# EAGLE design Board (EAGLE 9.2.2)
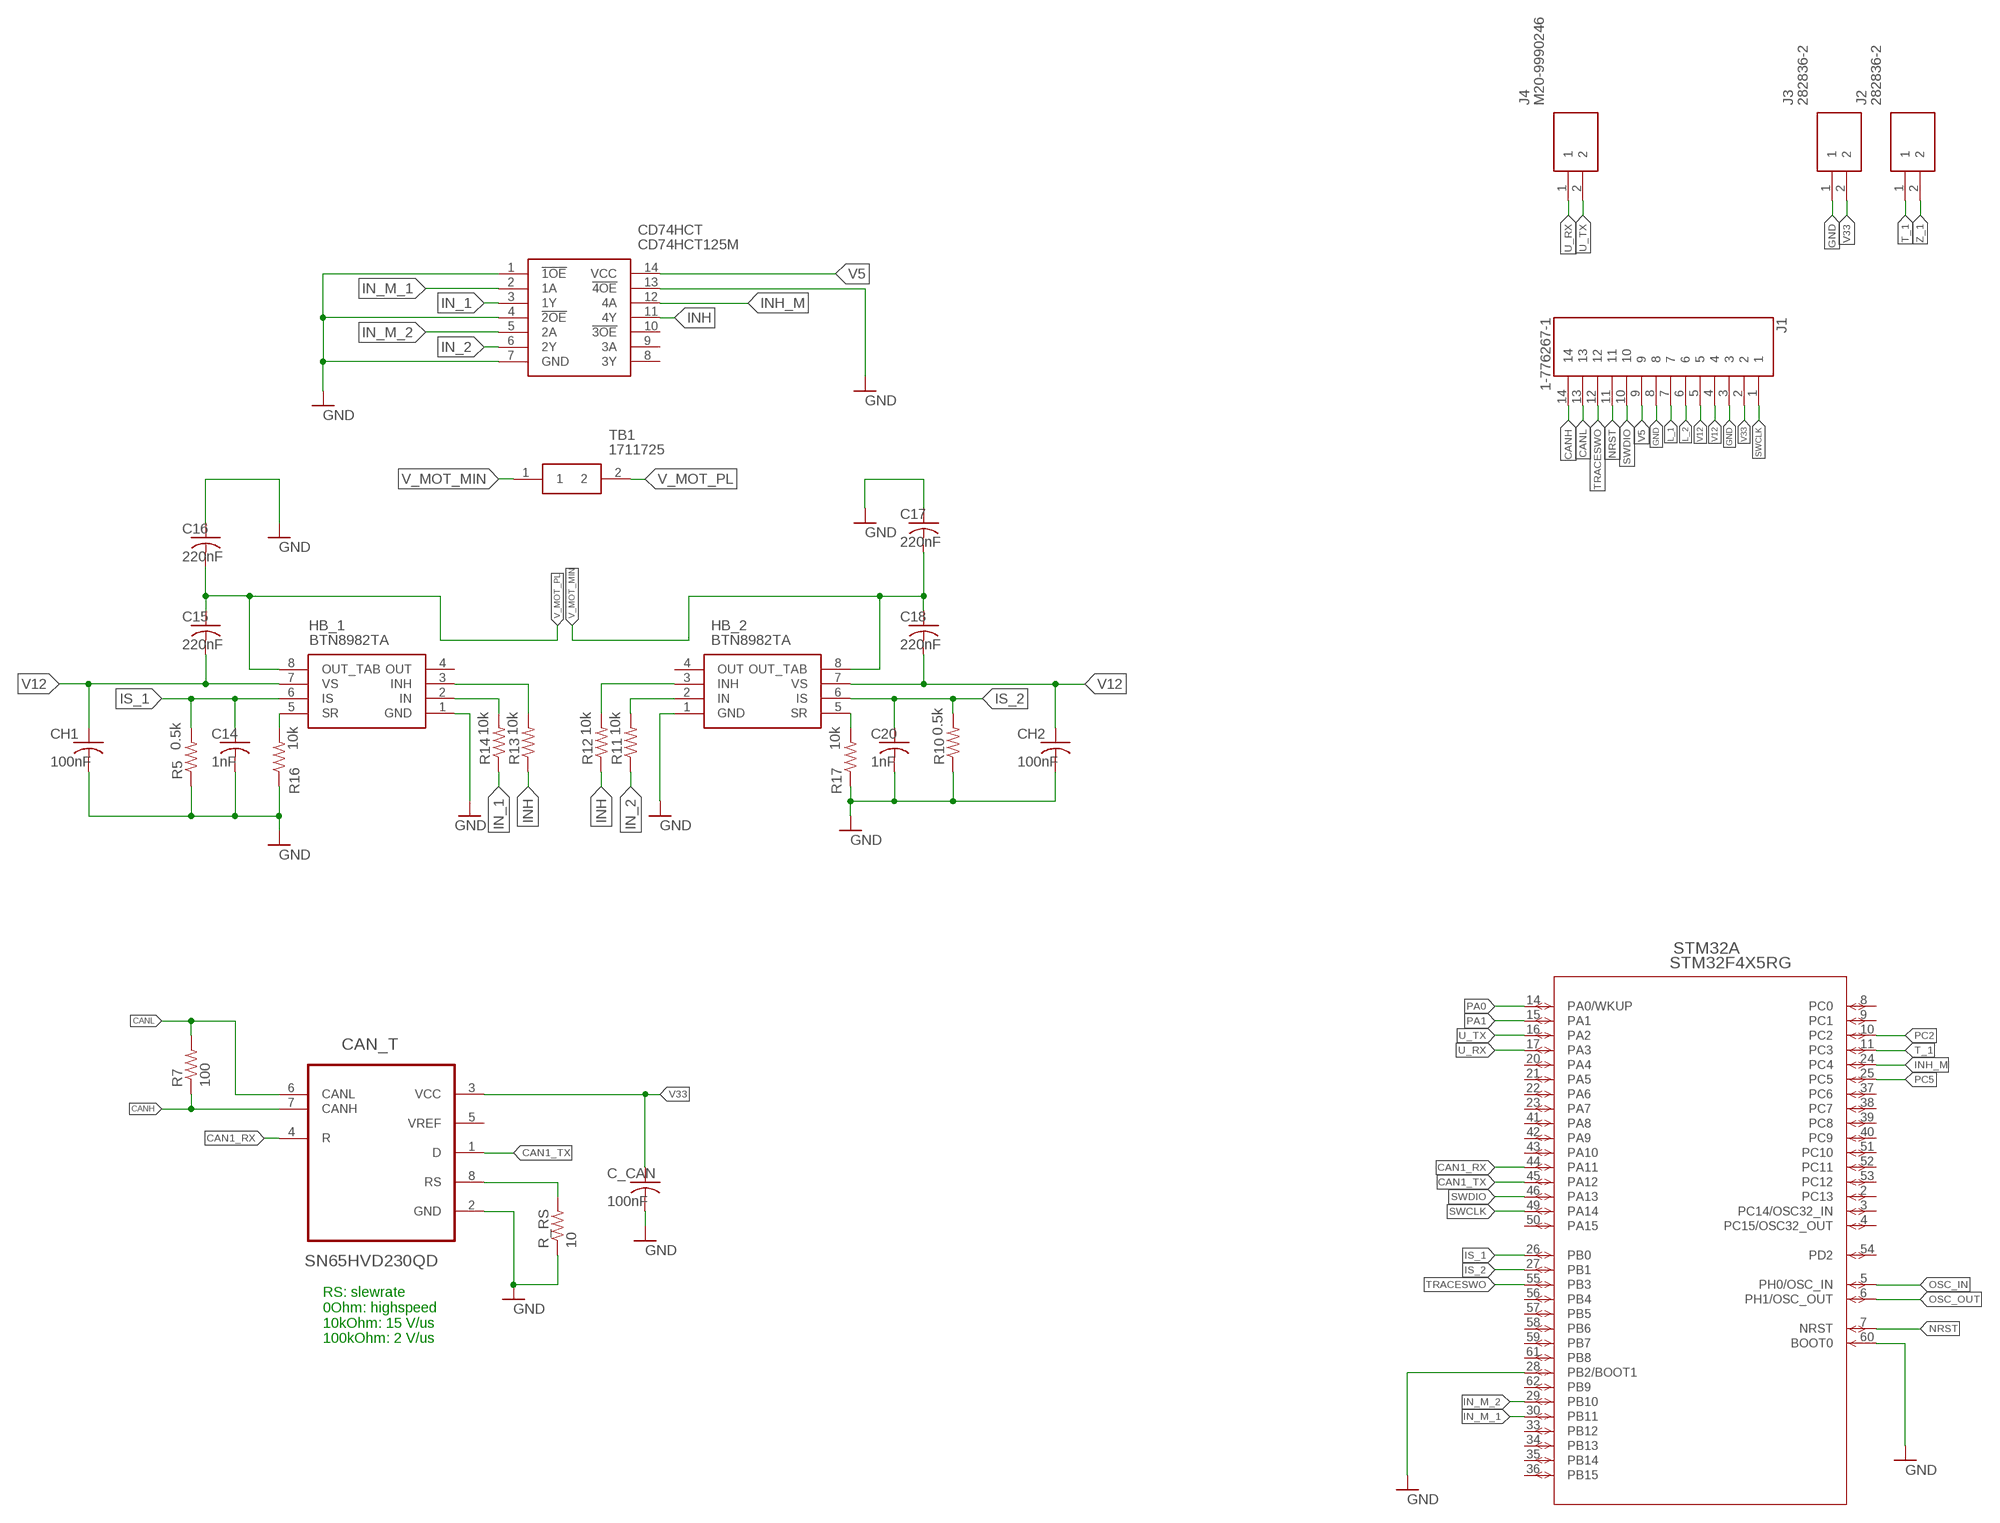
[diagram p0: schematic, sheet 1, part 1 of 2]
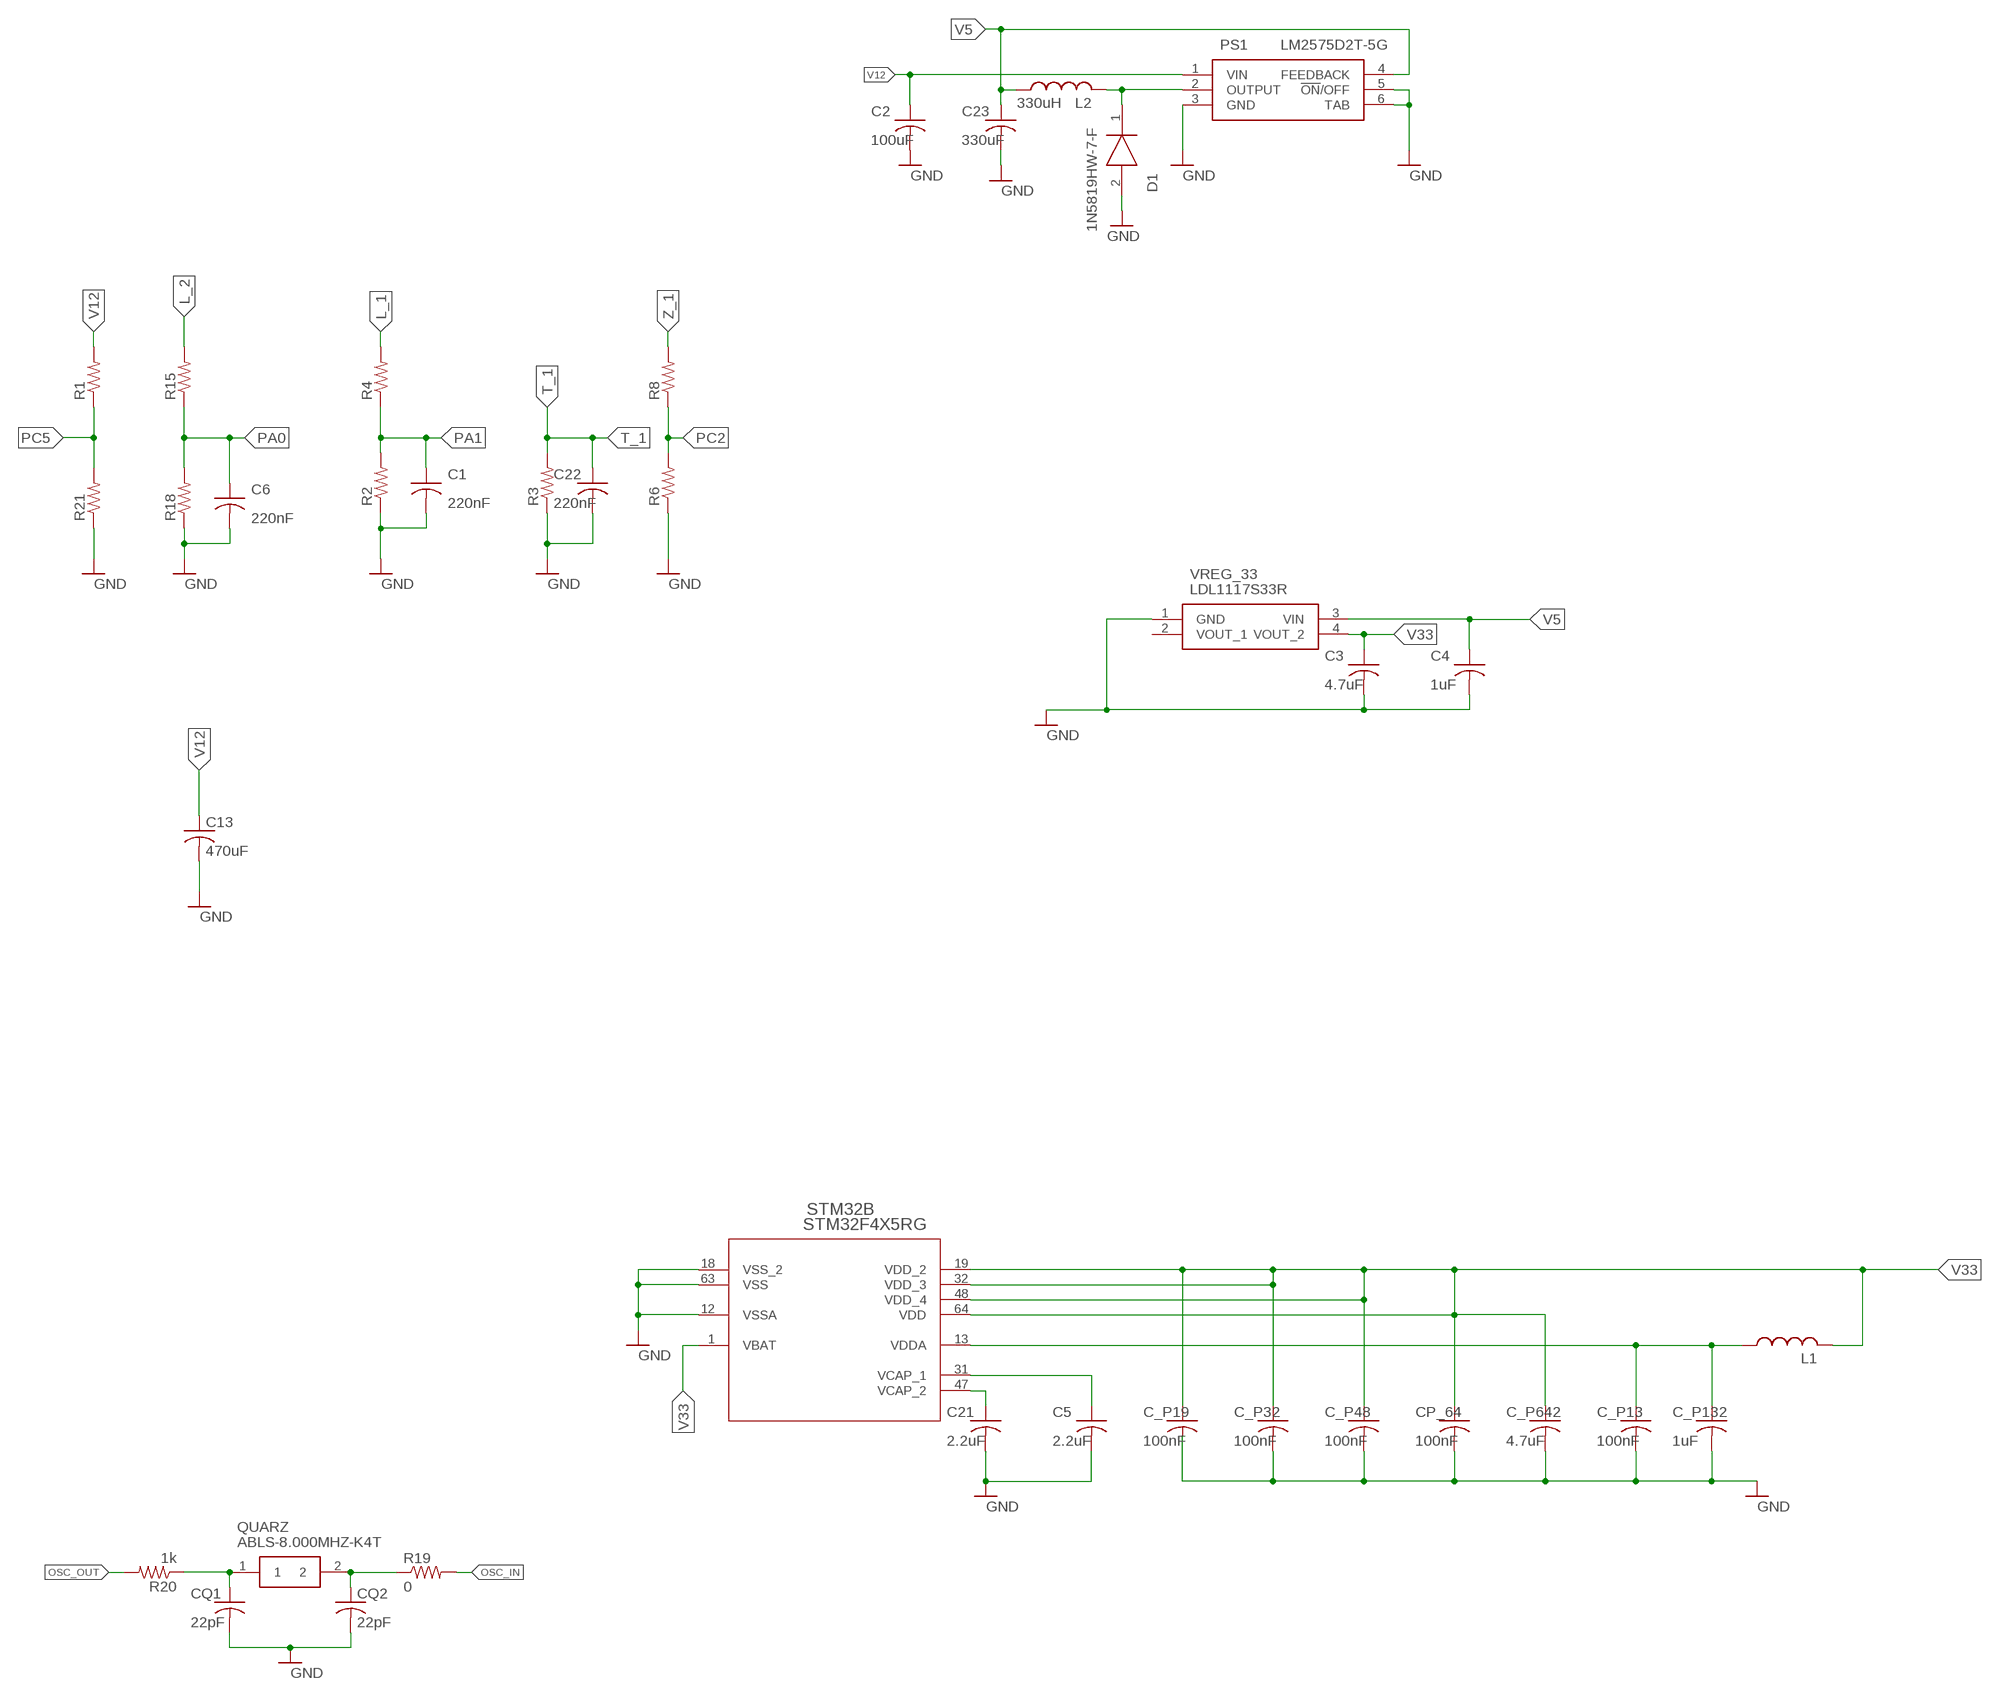
[diagram p1: schematic, sheet 1, part 2 of 2]

## Parts
C1  220nF  C-USC0805  [C0805]
C2  100uF  C-USC0805  [C0805]
C3  4.7uF  C-USC0805  [C0805]
C4  1uF  C-USC0805  [C0805]
C5  2.2uF  C-USC0805  [C0805]
C6  220nF  C-USC0805  [C0805]
C13  470uF  C-US050-075X075  [C050-075X075]
C14  1nF  C-USC0805  [C0805]
C15  220nF  C-USC0805  [C0805]
C16  220nF  C-USC0805  [C0805]
C17  220nF  C-USC0805  [C0805]
C18  220nF  C-USC0805  [C0805]
C20  1nF  C-USC0805  [C0805]
C21  2.2uF  C-USC0805  [C0805]
C22  220nF  C-USC0805  [C0805]
C23  330uF  C-USC0805  [C0805]
C_CAN  100nF  C-USC0805  [C0805]
C_P13  100nF  C-USC0805  [C0805]
C_P19  100nF  C-USC0805  [C0805]
C_P32  100nF  C-USC0805  [C0805]
C_P48  100nF  C-USC0805  [C0805]
C_P132  1uF  C-USC0805  [C0805]
C_P642  4.7uF  C-USC0805  [C0805]
CAN_T  SN65HVD230QD  [SOIC127P600X175-8N]
CD74HCT  CD74HCT125M  [SOIC127P600X175-14N]
CH1  100nF  C-USC0805  [C0805]
CH2  100nF  C-USC0805  [C0805]
CP_64  100nF  C-USC0805  [C0805]
CQ1  22pF  C-USC0805  [C0805]
CQ2  22pF  C-USC0805  [C0805]
D1  1N5819HW-7-F  [SOD3716X145N]
HB_1  BTN8982TA  [TO127P1500X440-8N]
HB_2  BTN8982TA  [TO127P1500X440-8N]
J1  1-776267-1  [TE_1-776267-1]
J2  282836-2  [SHDR2W100P0X500_1X2_1000X820X1]
J3  282836-2  [SHDR2W100P0X500_1X2_1000X820X1]
J4  M20-9990246  [HDRV2W64P0X254_1X2_508X254X864]
L1  INDUCTOR_0805_N  [RESC0805_N]
L2  330uH  INDUCTOR_0805_N  [RESC0805_N]
PS1  LM2575D2T-5G  [D2TSUFFIX-CASE936A-02-ISSUEC]
QUARZ  ABLS-8.000MHZ-K4T  [ABLS-12.000MHZ-B2]
R1  R-US_R0805  [R0805]
R2  R-US_R0805  [R0805]
R3  R-US_R0805  [R0805]
R4  R-US_R0805  [R0805]
R5  0.5k  R-US_R0805  [R0805]
R6  R-US_R0805  [R0805]
R7  100  R-US_R0805  [R0805]
R8  R-US_R0805  [R0805]
R10  0.5k  R-US_R0805  [R0805]
R11  10k  R-US_R0805  [R0805]
R12  10k  R-US_R0805  [R0805]
R13  10k  R-US_R0805  [R0805]
R14  10k  R-US_R0805  [R0805]
R15  R-US_R0805  [R0805]
R16  10k  R-US_R0805  [R0805]
R17  10k  R-US_R0805  [R0805]
R18  R-US_R0805  [R0805]
R19  0  R-US_R0805  [R0805]
R20  1k  R-US_R0805  [R0805]
R21  R-US_R0805  [R0805]
R_RS  10  R-US_R0805  [R0805]
STM32  STM32F4X5RG  [LQFP64-10X10MM]
TB1  1711725  [PHEONIX-5.08PITCH-2PIN]
VREG_33  LDL1117S33R  [SOT230P700X180-4N]

## Nets
CAN1_RX: CAN_T.4(R) STM32.44(A:PA11)
CAN1_TX: CAN_T.1(D) STM32.45(A:PA12)
CAN_RS: CAN_T.8(RS) R_RS.2
CANH: CAN_T.7(CANH) J1.14 R7.1
CANL: CAN_T.6(CANL) J1.13 R7.2
GND: C1.2 C2.2 C3.2 C4.2 C5.2 C6.2 C13.2 C14.2 C16.1 C17.1 C20.2 C21.2 C22.2 C23.2 C_CAN.2 C_P13.2 C_P19.2 C_P32.2 C_P48.2 C_P132.2 C_P642.2 CAN_T.2(GND) CD74HCT.1(!1OE) CD74HCT.4(!2OE) CD74HCT.7(GND) CD74HCT.13(!4OE) CH1.2 CH2.2 CP_64.2 CQ1.2 CQ2.2 D1.2(A) HB_1.1(GND) HB_2.1(GND) J1.3 J1.8 J3.1 PS1.3(GND) PS1.5(!ON!/OFF) PS1.6(TAB) R2.1 R3.1 R5.1 R6.1 R10.1 R16.1 R17.1 R18.1 R21.1 R_RS.1 STM32.12(B:VSSA) STM32.18(B:VSS_2) STM32.28(A:PB2/BOOT1) STM32.60(A:BOOT0) STM32.63(B:VSS) VREG_33.1(GND)
HB1_IN: HB_1.2(IN) R14.2
HB1_INH: HB_1.3(INH) R13.2
HB2_IN: HB_2.2(IN) R11.2
HB2_INH: HB_2.3(INH) R12.2
IN_1: CD74HCT.3(1Y) R14.1
IN_2: CD74HCT.6(2Y) R11.1
IN_M_1: CD74HCT.2(1A) STM32.30(A:PB11)
IN_M_2: CD74HCT.5(2A) STM32.29(A:PB10)
INH: CD74HCT.11(4Y) R12.1 R13.1
INH_M: CD74HCT.12(4A) STM32.24(A:PC4)
IS_1: C14.1 HB_1.6(IS) R5.2 STM32.26(A:PB0)
IS_2: C20.1 HB_2.6(IS) R10.2 STM32.27(A:PB1)
L_1: J1.7 R4.2
L_2: J1.6 R15.2
N$2: D1.1(K) L2.2 PS1.2(OUTPUT)
NRST: J1.11 STM32.7(A:NRST)
OSC_IN: R19.2 STM32.5(A:PH0/OSC_IN)
OSC_OUT: R20.2 STM32.6(A:PH1/OSC_OUT)
PA0: C6.1 R15.1 R18.2 STM32.14(A:PA0/WKUP)
PA1: C1.1 R2.2 R4.1 STM32.15(A:PA1)
PC2: R6.2 R8.1 STM32.10(A:PC2)
PC5: R1.1 R21.2 STM32.25(A:PC5)
Q_IN: CQ2.1 QUARZ.2 R19.1
Q_OUT: CQ1.1 QUARZ.1 R20.1
SR1: HB_1.5(SR) R16.2
SR2: HB_2.5(SR) R17.2
SWCLK: J1.1 STM32.49(A:PA14)
SWDIO: J1.10 STM32.46(A:PA13)
T_1: C22.1 J2.1 R3.2 STM32.11(A:PC3)
TRACESWO: J1.12 STM32.55(A:PB3)
U_RX: J4.1 STM32.17(A:PA3)
U_TX: J4.2 STM32.16(A:PA2)
V5: C4.1 C23.1 CD74HCT.14(VCC) J1.9 L2.1 PS1.4(FEEDBACK) VREG_33.3(VIN)
V12: C2.1 C13.1 C15.2 C18.2 CH1.1 CH2.1 HB_1.7(VS) HB_2.7(VS) J1.4 J1.5 PS1.1(VIN) R1.2
V33: C3.1 C_CAN.1 C_P19.1 C_P32.1 C_P48.1 C_P642.1 CAN_T.3(VCC) CP_64.1 J1.2 J3.2 L1.2 STM32.1(B:VBAT) STM32.19(B:VDD_2) STM32.32(B:VDD_3) STM32.48(B:VDD_4) STM32.64(B:VDD) VREG_33.4(VOUT_2)
V_MOT_MIN: C17.2 C18.1 HB_2.8(OUT_TAB) TB1.1
V_MOT_PL: C15.1 C16.2 HB_1.8(OUT_TAB) TB1.2
VCAP_1: C5.1 STM32.31(B:VCAP_1)
VCAP_2: C21.1 STM32.47(B:VCAP_2)
VDDA: C_P13.1 C_P132.1 L1.1 STM32.13(B:VDDA)
Z_1: J2.2 R8.2
Unconnected: CAN_T.5(VREF) CD74HCT.8(3Y) CD74HCT.9(3A) CD74HCT.10(!3OE) HB_1.4(OUT) HB_2.4(OUT) STM32.2(A:PC13) STM32.3(A:PC14/OSC32_IN) STM32.4(A:PC15/OSC32_OUT) STM32.8(A:PC0) STM32.9(A:PC1) STM32.20(A:PA4) STM32.21(A:PA5) STM32.22(A:PA6) STM32.23(A:PA7) STM32.33(A:PB12) STM32.34(A:PB13) STM32.35(A:PB14) STM32.36(A:PB15) STM32.37(A:PC6) STM32.38(A:PC7) STM32.39(A:PC8) STM32.40(A:PC9) STM32.41(A:PA8) STM32.42(A:PA9) STM32.43(A:PA10) STM32.50(A:PA15) STM32.51(A:PC10) STM32.52(A:PC11) STM32.53(A:PC12) STM32.54(A:PD2) STM32.56(A:PB4) STM32.57(A:PB5) STM32.58(A:PB6) STM32.59(A:PB7) STM32.61(A:PB8) STM32.62(A:PB9) VREG_33.2(VOUT_1)

## Notes on the sheet
- RS: slewrate
  0Ohm: highspeed
  10kOhm: 15 V/us
  100kOhm: 2 V/us

## Library data of the parts
C1-C6 C13-C18 C20-C23 C_CAN C_P13 C_P19 C_P32 C_P48 C_P132 C_P642 CH1 CH2 CP_64 CQ1 CQ2 = adafruit:C-US: CAPACITOR, American symbol
CAN_T = ADP_Components:SN65HVD230QD: 3.3-V CAN TRANSCEIVERS; MF: TEXAS INSTRUMENTS; MPN: SN65HVD230QD..; OC_FARNELL: 1648752; OC_NEWARK: 75C7746; PACKAGE: SOIC-8; SUPPLIER: Texas Instruments
CD74HCT = SamacSys_Parts:CD74HCT125M: High Speed CMOS Logic Quad Buffers with 3-State Outputs Source: Datasheet <http://www.ti.com/lit/ds/symlink/cd74hct125.pdf>; DESCRIPTION: High Speed CMOS Logic Quad Buffers with 3-State Outputs; HEIGHT: 1.75mm; MANUFACTURER_NAME: Texas Instruments; MANUFACTURER_PART_NUMBER: CD74HCT125M; MOUSER_PART_NUMBER: 595-CD74HCT125M
D1 = SamacSys_Parts:1N5819HW-7-F: Diode Schottky 1A 40V SOD123 Diodes Inc 1N5819HW-7-F, SMT Schottky Diode, 40V 1A, 2-Pin SOD-123 Source: Datasheet <https://componentsearchengine.com/Datasheets/1/1N5819HW-7-F.pdf>; DESCRIPTION: Diode Schottky 1A 40V SOD123 Diodes Inc 1N5819HW-7-F, SMT Schottky Diode, 40V 1A, 2-Pin SOD-123; HEIGHT: 1.45mm; MANUFACTURER_NAME: Diodes Inc.; MANUFACTURER_PART_NUMBER: 1N5819HW-7-F; MOUSER_PART_NUMBER: 621-1N5819HW-F; MOUSER_PRICE-STOCK: https://www.mouser.com/Search/Refine.aspx?Keyword=621-1N5819HW-F
HB_1 HB_2 = SamacSys_Parts:BTN8982TA: New Infineon BTN8982TA Motor Driver,, 7-Pin TO-263-7-1 Source: Datasheet <http://www.mouser.com/datasheet/2/196/Infineon-BTN8982TA-DS-v01_00-EN-786008.pdf>; DESCRIPTION: New Infineon BTN8982TA Motor Driver,, 7-Pin TO-263-7-1; HEIGHT: 4.4mm; MANUFACTURER_NAME: Infineon; MANUFACTURER_PART_NUMBER: BTN8982TA; MOUSER_PART_NUMBER: 726-BTN8982TA
J1 = 1-776267-1:1-776267-1: AMPSEAL 14 Position 4 mm Pitch Triple Row Wire to Board Right Angle Header; COMMENT: 1-776267-1; DESCRIPTION: AMPSEAL 14 Position 4 mm Pitch Triple Row Wire to Board Right Angle Header; DIGI-KEY_PART_NUMBER: A142413-ND; DIGI-KEY_PURCHASE_URL: https://www.digikey.com/product-detail/en/te-connectivity-amp-connectors/1-776267-1/A142413-ND/5428565?utm_source=snapeda&utm_medium=aggregator&utm_campaign=symbol; EU_ROHS_COMPLIANCE: Compliant; MF: TE Connectivity; MP: 1-776267-1; PACKAGE: None; TE_PURCHASE_URL: https://www.te.com/usa-en/product-1-776267-1.html?te_bu=Cor&te_type=disp&te_campaign=seda_glo_cor-seda-global-disp-prtnr-fy19-seda-model-bom-cta_sma-317_1&elqCampaignId=32493
J2 J3 = SamacSys_Parts:282836-2: TERMINAL BLOCK, PCB MOUNT, SIDE WIRE ENTRY, STACKING , 5.00mm PITCH Source: Datasheet <http://www.mouser.com/datasheet/2/418/NG_CD_282836_H10-1248046.pdf>; DESCRIPTION: TERMINAL BLOCK, PCB MOUNT, SIDE WIRE ENTRY, STACKING , 5.00mm PITCH; HEIGHT: 10.2mm; MANUFACTURER_NAME: TE Connectivity; MANUFACTURER_PART_NUMBER: 282836-2; MOUSER_PART_NUMBER: 571-2828362
J4 = SamacSys_Parts:M20-9990246: HARWIN M20-9990246. Board-To-Board Connector, Straight, 2.54 mm, 2 Contacts, Header, M20 Series, Through Hole Source: Datasheet <http://www.mouser.com/datasheet/2/181/M20-999-1218971.pdf>; DESCRIPTION: HARWIN M20-9990246. Board-To-Board Connector, Straight, 2.54 mm, 2 Contacts, Header, M20 Series, Through Hole; HEIGHT: 8.64mm; MANUFACTURER_NAME: HARWIN; MANUFACTURER_PART_NUMBER: M20-9990246; MOUSER_PART_NUMBER: 855-M20-9990246
L1 L2 = Nordic_nRF:INDUCTOR: Generic chip inductor
PS1 = SamacSys_Parts:LM2575D2T-5G: ON SEMICONDUCTOR - LM2575D2T-5G - IC, POWER SUPPLY D2PAK Source: Datasheet <https://componentsearchengine.com/Datasheets/1/LM2575D2T-5G.pdf>; DESCRIPTION: ON SEMICONDUCTOR - LM2575D2T-5G - IC, POWER SUPPLY D2PAK; HEIGHT: mm; MANUFACTURER_NAME: ON Semiconductor; MANUFACTURER_PART_NUMBER: LM2575D2T-5G; MOUSER_PART_NUMBER: 863-LM2575D2T-5G; MOUSER_PRICE-STOCK: https://www.mouser.com/Search/Refine.aspx?Keyword=863-LM2575D2T-5G
QUARZ = SamacSys_Parts:ABLS-8.000MHZ-K4T: ABRACON - ABLS-8.000MHZ-K4T - CRYSTAL, 8MHZ, 18PF, HC-49US Source: Datasheet <https://componentsearchengine.com/Datasheets/1/ABLS-8.000MHZ-K4T.pdf>; DESCRIPTION: ABRACON - ABLS-8.000MHZ-K4T - CRYSTAL, 8MHZ, 18PF, HC-49US; HEIGHT: mm; MANUFACTURER_NAME: ABRACON; MANUFACTURER_PART_NUMBER: ABLS-8.000MHZ-K4T; MF: ABRACON; MOUSER_PART_NUMBER: 815-ABLS-8.0MK4-T; MPN: ABLS-8.000MHZ-K4T; OC_FARNELL: 2467758
R1-R8 R10-R15 R18 R21 R_RS = adafruit:R-US_: RESISTOR, American symbol
R16 R17 R19 R20 = resistor:R-US_: RESISTOR, American symbol
STM32 = ADP_Components:STM32F4X5RG; MANUFACTURER_PART_NUMBER: STM32F4X5RG; OC_FARNELL: unknown; VENDOR: STMicroelectronics
TB1 = SamacSys_Parts:1711725: Non-Fused Terminal Block Through Hole, 2 Way, Solder, Nylon, 250 V Source: Datasheet; DESCRIPTION: Non-Fused Terminal Block Through Hole, 2 Way, Solder, Nylon, 250 V; HEIGHT: mm; MANUFACTURER_NAME: Phoenix Contact; MANUFACTURER_PART_NUMBER: 1711725; MOUSER_PART_NUMBER: 651-1711725; MOUSER_PRICE-STOCK: https://www.mouser.com/Search/Refine.aspx?Keyword=651-1711725
VREG_33 = SamacSys_Parts:LDL1117S33R: STMICROELECTRONICS - LDL1117S33R - LDO, FIXED, 3.3V, 1.2A, SOT-223-3 Source: Datasheet <http://www.mouser.com/datasheet/2/389/ldl1117-1156241.pdf>; DESCRIPTION: STMICROELECTRONICS - LDL1117S33R - LDO, FIXED, 3.3V, 1.2A, SOT-223-3; HEIGHT: 1.8mm; MANUFACTURER_NAME: STMicroelectronics; MANUFACTURER_PART_NUMBER: LDL1117S33R; MF: STMICROELECTRONICS; MOUSER_PART_NUMBER: 511-LDL1117S33R; MPN: LDL1117S33R; OC_FARNELL: 2729708

## Net classes
0 default: width 0.2 mm, drill 0.508 mm
1 V12: width 0.6 mm, drill 0.8 mm

## Board
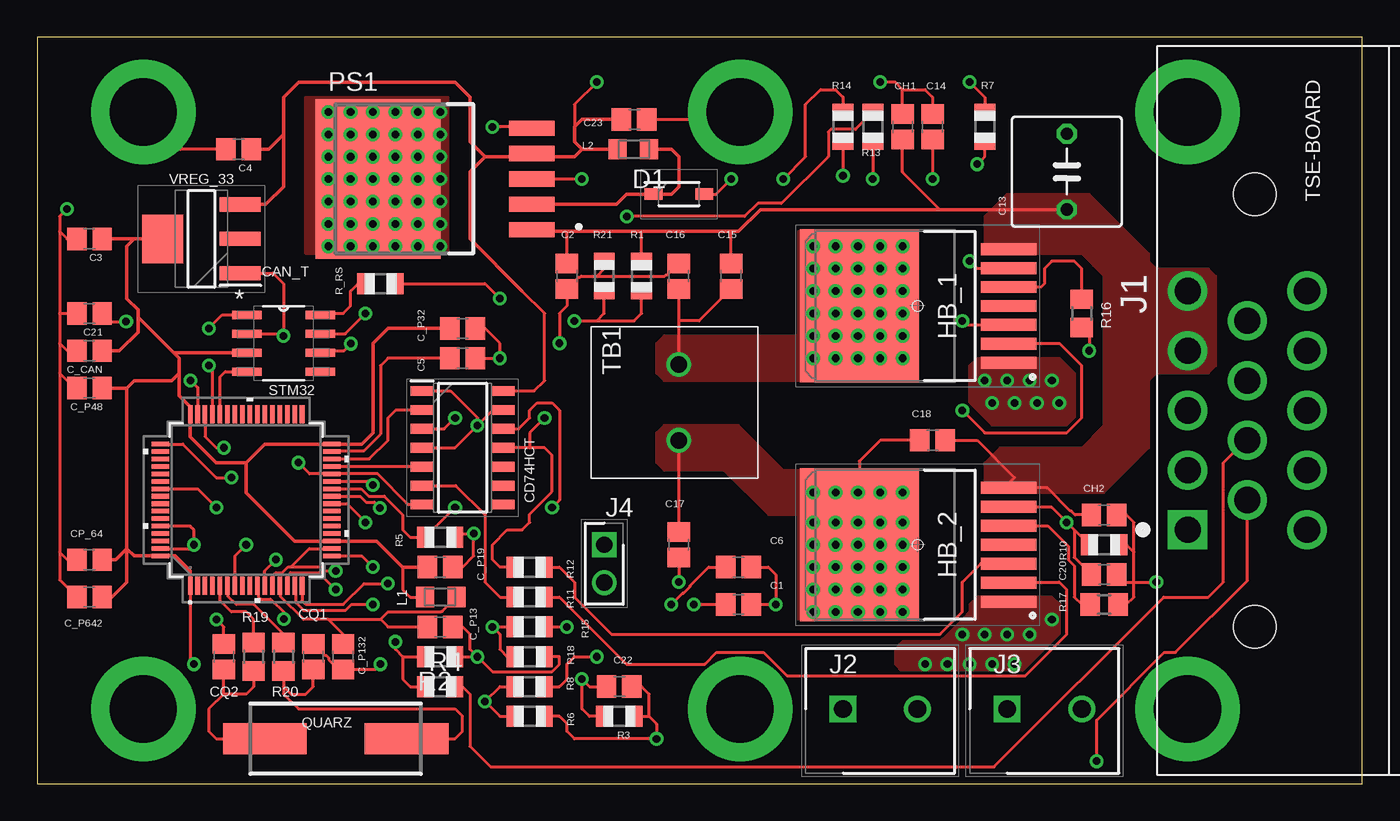
[diagram p2: board, top side]
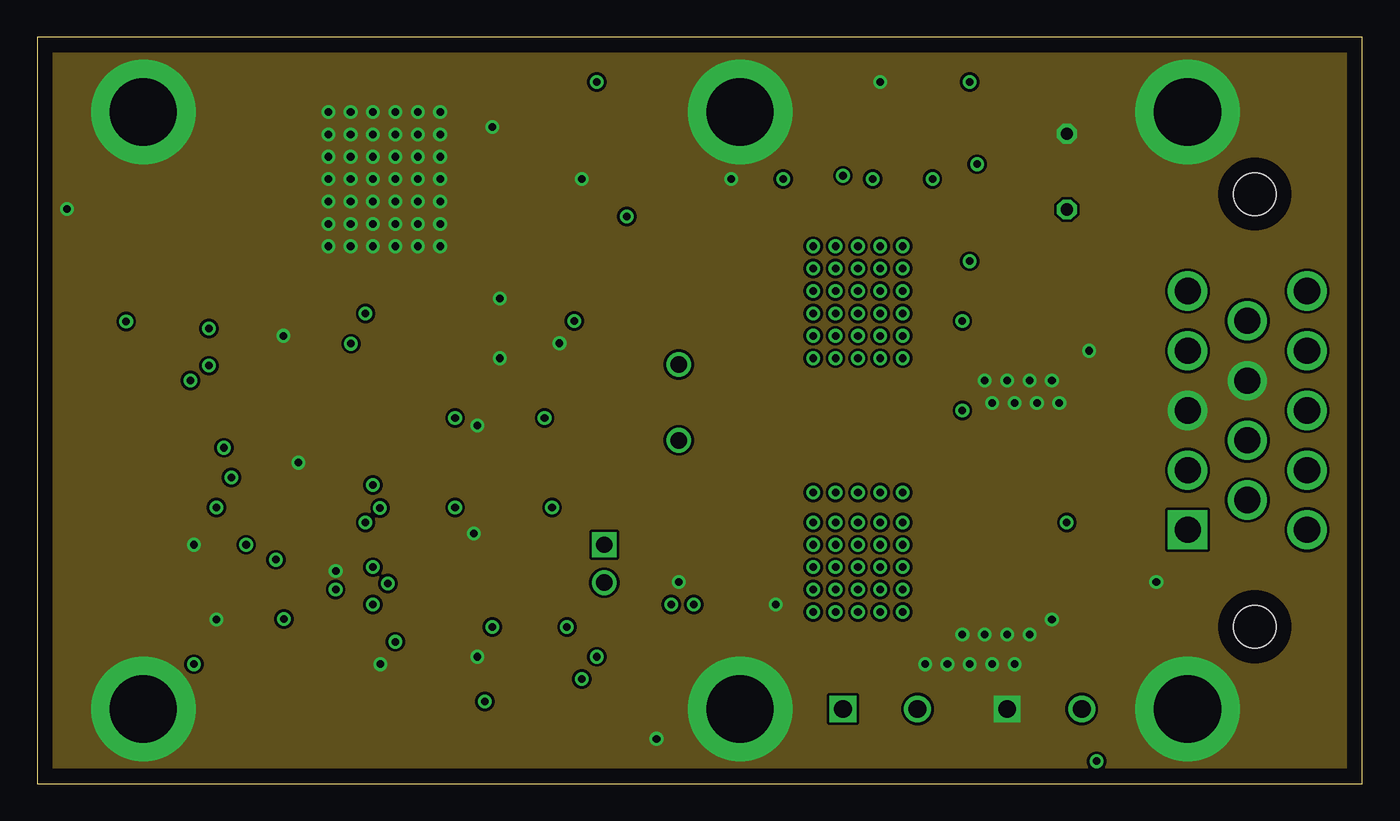
[diagram p3: board, inner layer Route2]
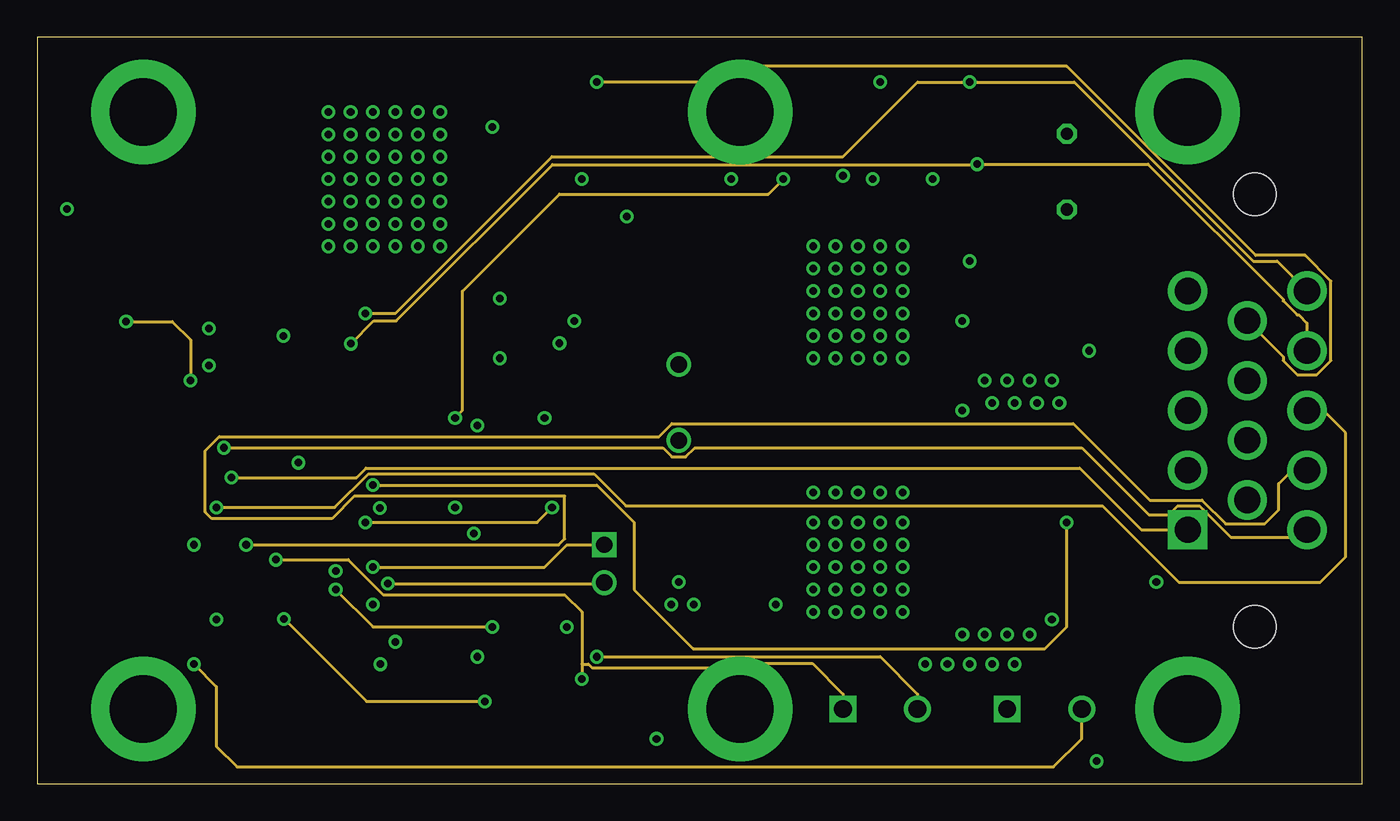
[diagram p4: board, inner layer Route15]
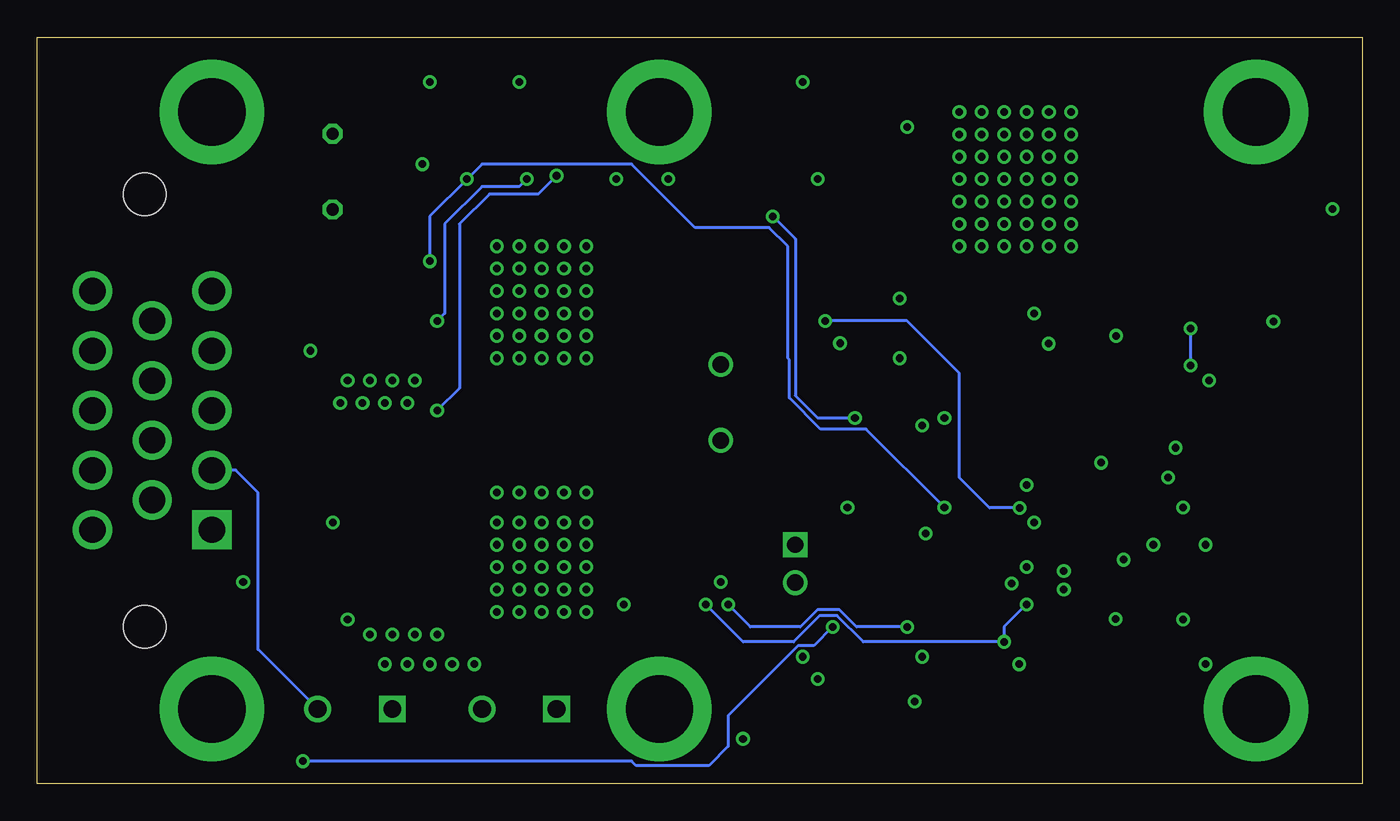
[diagram p5: board, bottom side, seen from below]

Size 88.8 x 50 mm. Coordinates in mm from the lower left corner, seen from the top.
Outline: 0,0 88.8,0 88.8,50 0,50 0,0
Copper layers (1+2*15+16): Top 0.07mm / dielectric 1.5mm / Route2 0.035mm / dielectric 0.15mm / Route15 0.035mm / dielectric 0.2mm / Bottom 0.07mm
Design rules "default *": minimum track width 6mil, minimum drill 0.35mm, track to track 0.19mm, track to pad 0.19mm, pad to pad 0.19mm, via to via 0.19mm, smd to smd 0.19mm, copper to edge 40mil, drill to drill 6mil, minimum pad ring 10mil, minimum via ring 8mil, stop-mask expansion 4mil, vias tented up to drill 0mil, thermal gap 10mil

### Footprints (pad centres in the part's own frame; a part is rotated, then mirrored left to right if it is on the bottom)
C0805 = smd 1.3 x 1.5: 1 -0.85,0; 2 0.85,0
C050-075X075 = drill 0.813 octagon: 1 -2.54,0; 2 2.54,0
SOIC127P600X175-8N = smd 1.981 x 0.559: 1 -2.464,1.905; 2 -2.464,0.635; 3 -2.464,-0.635; 4 -2.464,-1.905; 5 2.464,-1.905; 6 2.464,-0.635; 7 2.464,0.635; 8 2.464,1.905
SOIC127P600X175-14N = smd 1.525 x 0.65: 1 -2.712,3.81; 2 -2.712,2.54; 3 -2.712,1.27; 4 -2.712,0; 5 -2.712,-1.27; 6 -2.712,-2.54; 7 -2.712,-3.81; 8 2.712,-3.81; 9 2.712,-2.54; 10 2.712,-1.27; 11 2.712,0; 12 2.712,1.27; 13 2.712,2.54; 14 2.712,3.81
SOD3716X145N = smd 1.2 x 0.75: 1 -1.7,0; 2 1.7,0
TO127P1500X440-8N = smd 3.7 x 0.8: 1 -6.1,3.81; 2 -6.1,2.54; 3 -6.1,1.27; 4 -6.1,0; 5 -6.1,-1.27; 6 -6.1,-2.54; 7 -6.1,-3.81 | smd 8 x 10.25: 8 3.9,0
TE_1-776267-1 = drill 1.75 square: 1 -8,4.5 | drill 1.75: 2 -4,4.5; 3 0,4.5; 4 4,4.5; 5 8,4.5; 6 -6,0.5; 7 -2,0.5; 8 2,0.5; 9 6,0.5; 10 -8,-3.5; 11 -4,-3.5; 12 0,-3.5; 13 4,-3.5; 14 8,-3.5 | hole 2.85: -14.5,0; 14.5,0
SHDR2W100P0X500_1X2_1000X820X1 = drill 1.2 pad 1.8 square: 1 0,0 | drill 1.2 pad 1.8: 2 5,0
HDRV2W64P0X254_1X2_508X254X864 = drill 1.1 pad 1.65 square: 1 0,0 | drill 1.1 pad 1.65: 2 2.54,0
RESC0805_N = smd 1.2 x 1.35: 1 -1.1,0; 2 1,0
D2TSUFFIX-CASE936A-02-ISSUEC = smd 3.05 x 1.016: 1 13.155,1.606; 2 13.155,3.308; 3 13.155,5.01; 4 13.155,6.712; 5 13.155,8.414 | smd 8.38 x 10.66: 6 2.85,5.01
ABLS-12.000MHZ-B2 = smd 5.6 x 2.1: 1 -4.75,0; 2 4.75,0
R0805 = smd 1.1 x 1.4: 1 -1,0; 2 1,0
R0805' = smd 1.3 x 1.5: 1 -0.95,0; 2 0.95,0
LQFP64-10X10MM = smd 1.194 x 0.305: 1 -5.75,3.75; 2 -5.75,3.25; 3 -5.75,2.75; 4 -5.75,2.25; 5 -5.75,1.75; 6 -5.75,1.25; 7 -5.75,0.75; 8 -5.75,0.25; 9 -5.75,-0.25; 10 -5.75,-0.75; 11 -5.75,-1.25; 12 -5.75,-1.75; 13 -5.75,-2.25; 14 -5.75,-2.75; 15 -5.75,-3.25; 16 -5.75,-3.75; 33 5.75,-3.75; 34 5.75,-3.25; 35 5.75,-2.75; 36 5.75,-2.25; 37 5.75,-1.75; 38 5.75,-1.25; 39 5.75,-0.75; 40 5.75,-0.25; 41 5.75,0.25; 42 5.75,0.75; 43 5.75,1.25; 44 5.75,1.75; 45 5.75,2.25; 46 5.75,2.75; 47 5.75,3.25; 48 5.75,3.75 | smd 0.305 x 1.194: 17 -3.75,-5.75; 18 -3.25,-5.75; 19 -2.75,-5.75; 20 -2.25,-5.75; 21 -1.75,-5.75; 22 -1.25,-5.75; 23 -0.75,-5.75; 24 -0.25,-5.75; 25 0.25,-5.75; 26 0.75,-5.75; 27 1.25,-5.75; 28 1.75,-5.75; 29 2.25,-5.75; 30 2.75,-5.75; 31 3.25,-5.75; 32 3.75,-5.75; 49 3.75,5.75; 50 3.25,5.75; 51 2.75,5.75; 52 2.25,5.75; 53 1.75,5.75; 54 1.25,5.75; 55 0.75,5.75; 56 0.25,5.75; 57 -0.25,5.75; 58 -0.75,5.75; 59 -1.25,5.75; 60 -1.75,5.75; 61 -2.25,5.75; 62 -2.75,5.75; 63 -3.25,5.75; 64 -3.75,5.75
PHEONIX-5.08PITCH-2PIN = drill 1.1 pad 1.65: 1 0,0; 2 5.08,0
SOT230P700X180-4N = smd 2.75 x 0.95: 1 -2.6,2.3; 2 -2.6,0; 3 -2.6,-2.3 | smd 2.75 x 3.25: 4 2.6,0

### Placement (x,y rotation side)
C1  47,12 0 top
C2  35.5,34 270 top
C3  3.5,36.5 180 top
C4  13.5,42.5 180 top
C5  28.5,28.5 0 top
C6  47,14.5 0 top
C13  69,41 90 top
C14  60,44 90 top
C15  46.5,34 90 top
C16  43,34 270 top
C17  43,16 90 top
C18  60,23 0 top
C20  71.5,14 0 top
C21  3.5,31.5 180 top
C22  39,6.5 0 top
C23  40,44.5 0 top
C_CAN  3.5,29 180 top
C_P13  27,10.5 0 top
C_P19  27,14.5 0 top
C_P32  28.5,30.5 0 top
C_P48  3.5,26.5 180 top
C_P132  20.5,8.5 270 top
C_P642  3.5,12.5 180 top
CAN_T  16.5,29.5 0 top
CD74HCT  28.5,22.5 0 top
CH1  58,44 90 top
CH2  71.5,18 0 top
CP_64  3.5,15 180 top
CQ1  18.5,8.5 90 top
CQ2  12.5,8.5 90 top
D1  43,39.5 0 top
HB_1  59,32 180 top
HB_2  59,16 180 top
J1  81.6,25 90 top
J2  54,5 0 top
J3  65,5 0 top
J4  38,16 270 top
L1  27,12.5 180 top
L2  40,42.5 0 top
PS1  20,35.5 0 top
QUARZ  20,3 180 top
R1  40.5,34 90 top
R2  27,8.5 180 top
R3  39,4.5 180 top
R4  27,6.5 0 top
R5  27,16.5 180 top
R6  33,4.5 180 top
R7  63.5,44 270 top
R8  33,6.5 0 top
R10  71.5,16 180 top
R11  33,12.5 0 top
R12  33,14.5 0 top
R13  56,44 270 top
R14  54,44 270 top
R15  33,10.5 0 top
R16  10k  [R0805']  70,31.5 90 top
R17  10k  [R0805']  71.5,12 180 top
R18  33,8.5 180 top
R19  0  [R0805']  14.5,8.5 90 top
R20  1k  [R0805']  16.5,8.5 90 top
R21  38,34 270 top
R_RS  23,33.5 180 top
STM32  14,19 90 top
TB1  43,23 90 top
VREG_33  11,36.5 180 top

### Tracks (layer width: path | path; a pad name or v marks a point on that pad's centre or on a via)
CAN1_RX
  Top 0.2: STM32.44 12.25,27.25 12.6,27.59 CAN_T.4
CAN1_TX  (via drill 0.51)
  Top 0.2: STM32.45 11.75,27.75 v11.5,28 | v11.5,30.5 12.4,31.41 CAN_T.1
  Bottom 0.2: v11.5,28 v11.5,30.5
CAN_RS
  Top 0.2: CAN_T.8 19.06,31.5 20.5,31.5 21,32 21,33 21.5,33.5 R_RS.2
CANH  (via drill 0.51)
  Top 0.2: CAN_T.7 20.64,30.14 v22,31.5 | v62.5,47 63.5,46 R7.1
  Route15 0.2: v22,31.5 24,31.5 34.5,42 45.79,42 45.84,41.95 48.36,41.95 48.41,42 54,42 59,47 v62.5,47 69.5,47 81.5,35 83.1,35 J1.14
CANL  (via drill 0.51)
  Top 0.2: CAN_T.6 19.1,29 20.56,29 v21.03,29.47 | v63,41.5 63.5,42 R7.2
  Route15 0.2: v21.03,29.47 22.56,31 24.05,31 34.53,41.47 62.97,41.47 v63,41.5 74.45,41.5 83.5,32.45 83.5,32.34 84.44,31.4 84.55,31.4 85.1,30.85 J1.13
GND  (via drill 0.51, 4.5 pad 7)
  Top 0.2: v2,38.5 1.5,38 1.5,37 | 1.5,37 1.5,31.5 | 1.5,31.5 1.5,29.5 | 1.5,29.5 1.5,27.5 | 1.5,37 2,36.5 C3.2 | 1.5,31.5 C21.2 | 1.5,29.5 2,29 C_CAN.2 | 1.5,27.5 2.5,26.5 C_P48.2 | 1.5,27.5 1.5,15.5 | 1.5,15.5 1.5,13.65 C_P642.2 | 1.5,15.5 2,15 CP_64.2 | STM32.63 10.25,15.75 v10.5,16 10.5,17 10.25,17.25 STM32.60 | STM32.12 15.81,13.31 15.81,13.97 15.98,14.14 16.43,14.14 16.82,14.53 17,14.53 | v20,14.25 19.3,14.25 19.02,14.53 17,14.53 | v17.5,21.5 18.25,20.75 STM32.28 22.81,20.75 24.87,18.69 CD74HCT.7 | CD74HCT.4 28,22.5 v29.5,24 | v29.5,24 30.54,25.04 CD74HCT.13 | CD74HCT.1 27.69,26.31 29.5,24.5 v29.5,24 | C5.2 v31,28.5 31,29.5 30,30.5 C_P32.2 | R2.1 v29.5,8.5 | v29.5,8.5 30.5,7.5 34.5,7.5 35,8 35,8.5 R18.1 | R3.1 41,4.5 | 41,4.5 41.5,4 v41.5,3 36,3 35.5,3.5 35.5,4 35,4.5 R6.1 | 41,4.5 41,6 40.5,6.5 C22.2 | C17.1 v43,13.5 | R_RS.1 30,33.5 v31,32.5 | v35,29.5 35,31.5 35.5,32 C2.2 36.26,33.91 36.37,33.91 36.46,34 37.5,34 | 37.5,34 38,34.5 R21.1 | C16.1 42.24,34.09 42.13,34.09 42.04,34 37.5,34 | D1.2 45.5,39.5 v46.5,40.5 | CH1.2 58,46.5 | 58,46.5 57.5,47 v56.5,47 | 58,46.5 59.5,46.5 60,46 C14.2 | R16.1 70.5,30.05 v70.5,29 | C20.2 72.85,13.5 73.5,13.5 | 73.5,13.5 v75,13.5 | 73.5,13.5 73.5,15.5 | 73.5,15.5 73,16 R10.1 | 73.5,15.5 73.5,17.5 73,18 CH2.2 | R17.1 73,12 73.5,12.5 73.5,13.5 | PS1.3 v36.49,40.51 v36.5,40.5 | PS1.5 33.07,44 v30.5,44 | C23.2 46.6,44.5 v47.1,45 | C4.2 9.6,42.5 v7.1,45 | CAN_T.2 16.36,30.14 v16.5,30 16.5,33.5 15.8,34.2 VREG_33.1 | R5.1 28.25,16.75 v29.25,16.75 29.25,15.25 28.5,14.5 C_P19.2 | v29.5,8.5 29,9 29,10 28.5,10.5 C_P13.2 | CQ2.2 12.5,10.5 v12,11 | CQ1.2 19.26,8.59 19.37,8.59 19.54,8.42 19.54,8.31 20.2,7.65 C_P132.2 22.65,7.65 v23,8
  Top 0.2: 17,14.53 18.22,15.75 STM32.18 | C1.2 v49.5,12 49.5,14 49,14.5 C6.2
  other vias: 77.1,45 7.1,5 47.1,5 77.1,5 19.5,45 21,45 22.5,45 24,45 25.5,45 27,45 19.5,43.5 21,43.5 22.5,43.5 24,43.5 25.5,43.5 27,43.5 19.5,42 21,42 22.5,42 24,42 25.5,42 27,42 19.5,40.5 21,40.5 24,40.5 25.5,40.5 27,40.5 19.5,39 21,39 22.5,39 24,39 25.5,39 27,39 19.5,37.5 21,37.5 22.5,37.5 24,37.5 25.5,37.5 27,37.5 19.5,36 21,36 22.5,36 24,36 25.5,36 27,36 63.5,10 65,10 66.5,10 68,11 62,10 65.5,8 64,8 62.5,8 61,8 59.5,8 63.5,27 65,27 66.5,27 68,27 68.5,25.5 67,25.5 65.5,25.5 64,25.5 22.5,40.5
  pour Route2 (no thermals): -0.5,52.5 -0.5,-0.5 0,-1 93,-1 94,0 94,49 90.5,52.5
  pour Top (no thermals): 63.5,12.5 63,12.5 62.5,12 62.5,11.5 60.5,9.5 58,9.5 57.5,9 57.5,8 58,7.5 66,7.5 68.5,10 68.5,12 68,12.5 66.5,12.5
  pour Top (no thermals): 63.5,28.5 67,28.5 68.5,28.5 69.5,27.5 69.5,25 69.5,24.5 69,24 64,24 62.5,25.5 62.5,26 62.5,28 63,28.5
  pour Top (no thermals): 18,46 27.5,46 27.5,35.5 18,35.5
HB1_IN  (via drill 0.51)
  Top 0.2: R14.2 v54,40.73 | v62,25 63.5,23.5 69,23.5 70,24.5 70,28 68.54,29.46 HB_1.2
  Bottom 0.2: v54,40.73 55.23,39.5 58.5,39.5 60.5,37.5 60.5,26.5 v62,25
HB1_INH  (via drill 0.51)
  Top 0.2: R13.2 v56,40.5 | v62,31 62.27,30.73 HB_1.3
  Bottom 0.2: v56,40.5 56.5,40 59,40 61.5,37.5 61.5,31.5 v62,31
HB2_IN
  Top 0.2: R11.2 35,12.5 39.5,8 44.74,8 45.53,8.79 48.67,8.79 50.23,7.23 66.23,7.23 69,10 69,13 68.5,13.5 68.46,13.46 HB_2.2
HB2_INH
  Top 0.2: R12.2 35,14.5 36,13.5 36,12.5 38.5,10 60.5,10 62,11.5 62,13.5 63.23,14.73 HB_2.3
IN_1  (via drill 0.51)
  Top 0.2: CD74HCT.3 27.27,23.77 v28,24.5 | v50,40.5 51.5,42 51.5,45.5 52.5,46.5 53.5,46.5 54,46 R14.1
  Route15 0.2: v28,24.5 28.5,25 28.5,33 35,39.5 49,39.5 v50,40.5
IN_2
  Top 0.2: CD74HCT.6 28.04,19.96 30,18 30,13.5 31,12.5 R11.1
IN_M_1
  Top 0.2: STM32.30 22.25,21.75 23.5,23 23.5,24.5 24.04,25.04 CD74HCT.2
IN_M_2
  Top 0.2: STM32.29 25.77,21.25 CD74HCT.5
INH  (via drill 0.51)
  Top 0.2: R12.1 31,14.5 30.5,15 30.5,16 31.5,17 32.5,17 33,17.5 33,18.06 34.5,19.56 34.5,22 34,22.5 33,22.5 | 33,22.5 CD74HCT.11 | v39.5,38 47.41,38 48.29,38.88 49.88,38.88 53.01,42.01 53.01,43.67 53.18,43.84 54.84,43.84 R13.1 | v34,24.5 33,23.5 33,22.5
  Bottom 0.2: v39.5,38 38,36.5 38,26 36.5,24.5 v34,24.5
INH_M  (via drill 0.51)
  Top 0.2: STM32.24 20.75,18.75 v22,17.5 | v34.5,18.5 35,19 35,25 34.5,25.5 33.5,25.5 33,25 33,24.5 32.27,23.77 CD74HCT.12
  Route15 0.2: v22,17.5 33.5,17.5 v34.5,18.5
IS_1  (via drill 0.51)
  Top 0.2: STM32.26 21.69,19.75 22.19,19.25 23.25,19.25 24.5,18 24.5,17 25,16.5 R5.2 v28,18.5 | C14.1 v60,40.5 | v62.5,35 62.96,34.54 HB_1.6
  Bottom 0.2: v62.5,35 62.5,38 v60,40.5 59,41.5 48.96,41.5 44.71,37.25 39.75,37.25 38.5,36 38.5,28.5 38.39,28.39 38.39,25.84 36.3,23.75 33.25,23.75 v28,18.5
IS_2  (via drill 0.51)
  Top 0.2: STM32.27 22.25,20.25 v22.5,20 | HB_2.6 65.14,18.5 68,18.5 v69,17.5 69.5,17 | 69.5,17 R10.2 | 69.5,17 69.5,15.15 C20.1
  Route15 0.2: v22.5,20 37.5,20 40,17.5 40,13 43.95,9.05 67.55,9.05 69,10.5 v69,17.5
L_1
  Top 0.2: R4.2 28.5,6.5 29,6 29,2.5 30.38,1.12 64.12,1.12 75.5,12.5 78.5,12.5 79.5,13.5 79.5,18.33 79.5,18.34 79.5,19.66 79.5,19.67 79.5,21.5 81,23 J1.7
L_2  (via drill 0.51)
  Top 0.2: R15.2 v35.5,10.5 | v71,1.5 71,4.26 75.53,8.79 76.29,8.79 81.1,13.6 J1.6
  Bottom 0.2: v35.5,10.5 36.75,9.25 37.81,9.25 42.5,4.56 42.5,2.5 43.79,1.21 48.67,1.21 48.96,1.5 v71,1.5
N$2
  Top 0.25: PS1.2 38.81,38.81 39.5,39.5 D1.1 42.5,39.5 43,40 43,42 42.5,42.5 L2.2
NRST  (via drill 0.51)
  Top 0.2: STM32.7 13.25,15.25 v14,16
  Route15 0.2: v14,16 34.95,16 35.34,16.39 35.34,19.25 21.25,19.25 19.75,17.75 11.69,17.75 11.25,18.19 11.25,22.31 12.19,23.25 41.67,23.25 42.54,24.11 69.44,24.11 74.56,18.99 78.06,18.99 79.65,17.4 82.26,17.4 83.2,18.34 83.2,20.1 84.1,21 J1.11
OSC_IN
  Top 0.2: R19.2 14.5,11 14,11.5 13,11.5 12.25,12.25 STM32.5
OSC_OUT
  Top 0.2: R20.2 16.5,10 14.5,12 13.34,12 12.81,12.53 12.81,13.19 STM32.6
PA0  (via drill 0.51)
  Top 0.2: STM32.14 16.81,13.31 16.81,13.97 16.98,14.14 18.86,14.14 v20,13 | R15.1 v30.5,10.5 31,10 31,9 31.5,8.5 R18.2 | C6.1 45,14.5 43.75,13.25 43.75,13.19 43.31,12.75 43.25,12.75 v42.5,12
  Route15 0.2: v20,13 22.5,10.5 v30.5,10.5
  Bottom 0.2: v42.5,12 41,10.5 37.66,10.5 36.52,11.64 35.03,11.64 33.89,10.5 v30.5,10.5
PA1  (via drill 0.51)
  Top 0.2: STM32.15 17.31,13.19 17.31,12.14 17.84,11.61 20.66,11.61 21.05,12 v22.5,12 | v24,9.5 24,9 24.5,8.5 | 24.5,8.5 R2.2 | 24.5,8.5 24.5,7 25,6.5 R4.1 | v44,12 C1.1
  Bottom 0.2: v22.5,12 24,10.5 v24,9.5 33.44,9.5 35.19,11.25 36.36,11.25 38.11,9.5 41.5,9.5 v44,12
PC2  (via drill 0.51)
  Top 0.2: v16.53,11.03 16.53,11.47 15.64,12.36 14.98,12.36 14.81,12.53 14.81,13.19 STM32.10 | R8.1 31,6.5 v30,5.5 31,4.5 R6.2
  Route15 0.2: v16.53,11.03 22.06,5.5 v30,5.5
PC5  (via drill 0.51)
  Top 0.2: STM32.25 21.64,19.25 22.03,18.86 22.58,18.86 v22.97,18.47 | v36,31 37.5,31 | 37.5,31 38,31.5 R21.2 | R1.1 40.5,31.5 40,31 37.5,31
  Bottom 0.2: v22.97,18.47 24.97,18.47 27,20.5 27,27.5 30.5,31 v36,31
Q_IN
  Top 0.2: R19.1 14.5,6.5 14,6 12.5,6 | 12.5,6 11.5,5 11.5,3.5 12,3 QUARZ.2 | 12.5,6 CQ2.1
Q_OUT
  Top 0.2: QUARZ.1 28,3 28.5,3.5 28.5,4.5 28,5 17.5,5 16.5,6 16.5,6.5 | R20.1 16.5,6.5 | 16.5,6.5 17,6 18,6 18.5,6.5 CQ1.1
SR1
  Top 0.2: R16.2 70,34.5 69.5,35 68,35 67.5,34.5 67.5,33.5 67.27,33.27 HB_1.5
SR2
  Top 0.2: HB_2.5 67.73,17.27 69.11,15.89 69.11,14.99 69.5,14.6 69.5,12.5 70,12 R17.2
SWCLK  (via drill 0.51)
  Top 0.2: STM32.49 9.75,22.75 12,20.5 v13,20.5
  Route15 0.2: v13,20.5 21.39,20.5 22.03,21.14 69.86,21.14 74,17 J1.1
SWDIO  (via drill 0.51)
  Top 0.2: STM32.46 11.25,23.25 12,22.5 v12.5,22.5
  Route15 0.2: v12.5,22.5 41.92,22.5 42.54,21.89 43.46,21.89 44.08,22.5 70,22.5 74.5,18 75.83,18 76.44,18.6 77.9,18.6 80,16.5 84.6,16.5 J1.10
T_1  (via drill 0.51)
  Top 0.2: STM32.11 15.25,14.25 v16,15 | C22.1 37,6.5 v36.5,7 36.5,5 37,4.5 R3.2
  Route15 0.2: v16,15 20.84,15 23.19,12.65 35.35,12.65 36.5,11.5 36.5,8 | 36.5,8 v36.5,7 | 36.5,8 36.94,8 37.19,7.75 45.54,7.75 45.84,8.05 51.95,8.05 54,6 J2.1
TRACESWO  (via drill 0.51)
  Top 0.2: STM32.55 10.75,19.75 v12,18.5
  Route15 0.2: v12,18.5 19.94,18.5 22.19,20.75 37.3,20.75 39.45,18.6 71.4,18.6 76.5,13.5 86,13.5 87.68,15.18 87.68,23.5 86.18,25 J1.12
U_RX  (via drill 0.51)
  Top 0.2: STM32.17 21.75,15.25 v22.5,14.5
  Route15 0.2: v22.5,14.5 34,14.5 35.5,16 J4.1
U_TX  (via drill 0.51)
  Top 0.2: STM32.16 17.75,12.25 18,12 20.5,12 21.9,13.4 v23.5,13.4
  Route15 0.2: v23.5,13.4 37.94,13.4 J4.2
V5  (via drill 0.51)
  Top 0.2: CD74HCT.14 33.31,26.31 34,27 34,31.5 32.5,33 | v37.5,47 36,45.5 36,44
  Top 0.25: L2.1 36.5,42.5 | 36.5,42.5 36,42 33.37,42 PS1.4 32.94,42 30,42 | 36.5,42.5 36,43 36,44 36.5,44.5 C23.1 | C4.1 15.5,42.5 16.5,43.5 | 30,42 29,43 29,46 28,47 17.5,47 16.5,46 16.5,43.5 | 16.5,43.5 16.5,40 15.3,38.8 VREG_33.3 | 32.5,33 29,36.5 29,41 30,42
  Route15 0.2: v37.5,47 44.79,47 45.84,48.05 69,48.05 81.66,35.39 84.98,35.39 86.7,33.66 86.7,28.34 85.76,27.4 84.44,27.4 83.5,28.34 83.5,28.6 J1.9
V12
  Top 0.2: 60.5,38.46 58,40.96 CH1.1 | C15.2 46.5,37 | C2.1 35.5,37 | R1.2 40.5,37 | C18.2 63,23 65.5,20.5 65.1,20.1 HB_2.7 67.69,19.81 69.25,18.25 69.31,18.25 69.56,18 CH2.1
  Top 0.25: C13.1 60.5,38.46 48.46,38.46 47,37 46.5,37 40.5,37 35.5,37 33.26,37 PS1.1
  pour Top (no thermals): 63.5,19.5 71.5,19.5 74.5,22.5 74.5,27 75,27.5 78.5,27.5 79,28 79,34 78.5,34.5 75,34.5 74.5,35 74.5,35.5 70.5,39.5 65,39.5 63.5,38 63.5,35.5 70,35.5 71.5,34 71.5,24 70,22.5 64.5,22.5 63.5,21.5
V33  (via drill 0.51)
  Top 0.2: STM32.1 10.25,8.25 v10.5,8 | 24.5,14.5 24.5,13 25,12.5 L1.2
  Top 0.25: 9.13,28.86 CAN_T.3 | C3.1 VREG_33.4 6.5,36.5 6,36 6,32.5 6.75,31.75 6.75,31.25 | 6.75,31.25 9.13,28.86 | C_CAN.1 5.5,29 6.75,30.25 6.75,31.25 | 9.13,28.86 9.5,28.5 9.5,27.5 | 9.5,27.5 9,27 6.5,27 6,26.5 | C_P48.1 6,26.5 | C_P642.1 5,12.5 6,13.5 6,15.75 | 6,15.75 6.5,15.25 STM32.64 9.25,15.25 10.25,14.25 STM32.1 | 6,26.5 6,15.75 | CP_64.1 5.25,15 6,15.75 | C_P19.1 24.5,14.5 22.75,16.25 STM32.19 17.25,16.25 14,19.5 14,21.5 | C_P32.1 23.5,30.5 22.5,29.5 22.5,23.5 21.75,22.75 STM32.32 15.25,22.75 14,21.5 | 14,21.5 12,21.5 10.25,23.25 STM32.48 10.25,25.25 9.5,26 9.5,27.5
  Route15 0.2: v10.5,8 12,6.5 12,2.5 13.38,1.12 68.12,1.12 70,3 J3.2
  Bottom 0.2: J3.2 74,9 74,19.5 75.5,21 J1.2
V_MOT_MIN  (via drill 0.51)
  Top 0.2: C17.2 TB1.1 | C18.1 56.5,23 55.1,21.6 HB_2.8
  other vias: 52,19.5 53.5,19.5 55,19.5 56.5,19.5 58,19.5 52,17.5 53.5,17.5 55,17.5 56.5,17.5 58,17.5 52,16 53.5,16 55,16 56.5,16 58,16 52,14.5 53.5,14.5 55,14.5 56.5,14.5 58,14.5 52,13 53.5,13 55,13 56.5,13 58,13 52,11.5 53.5,11.5 55,11.5 56.5,11.5 58,11.5
  pour Top (no thermals): 42,24 47,24 50,21 59,21 59,11 51,11 51,18 49,18 46,21 42,21 41.5,21.5 41.5,23.5
V_MOT_PL  (via drill 0.51)
  Top 0.2: TB1.2 43,31 | 43,31 C16.2 | C15.1 44.35,31 43,31
  other vias: 52,36 53.5,36 55,36 56.5,36 58,36 52,34.5 53.5,34.5 55,34.5 56.5,34.5 58,34.5 52,33 53.5,33 55,33 56.5,33 58,33 52,31.5 53.5,31.5 55,31.5 56.5,31.5 58,31.5 52,30 53.5,30 55,30 56.5,30 58,30 52,28.5 53.5,28.5 55,28.5 56.5,28.5 58,28.5
  pour Top (no thermals): 59,37 51,37 51,30 42,30 41.5,29.5 41.5,27.5 42,27 59,27
VCAP_1
  Top 0.2: STM32.31 19.81,22.31 21.89,22.31 23,23.41 23,28 23.5,28.5 C5.1
VCAP_2  (via drill 0.51)
  Top 0.2: C21.1 4.9,30.95 v5.95,30.95 | v10.27,27 10.75,26.52 STM32.47
  Route15 0.2: v5.95,30.95 9.05,30.95 10.27,29.73 v10.27,27
VDDA
  Top 0.2: C_P132.1 20.5,10 19.5,11 | STM32.13 16.31,13.19 16.31,12.53 17.84,11 19.5,11 | 23,11 23.5,10.5 C_P13.1 | 19.5,11 23,11 | 23,11 23.5,11.5 27.04,11.5 27.08,11.54 27.14,11.54 L1.1
Z_1  (via drill 0.51)
  Top 0.2: R8.2 35,6.5 35.5,7 35.5,8 36,8.5 v37.5,8.5
  Route15 0.2: J2.2 59,6 56.5,8.5 v37.5,8.5

### Text on the board
tPlace: TSE-BOARD